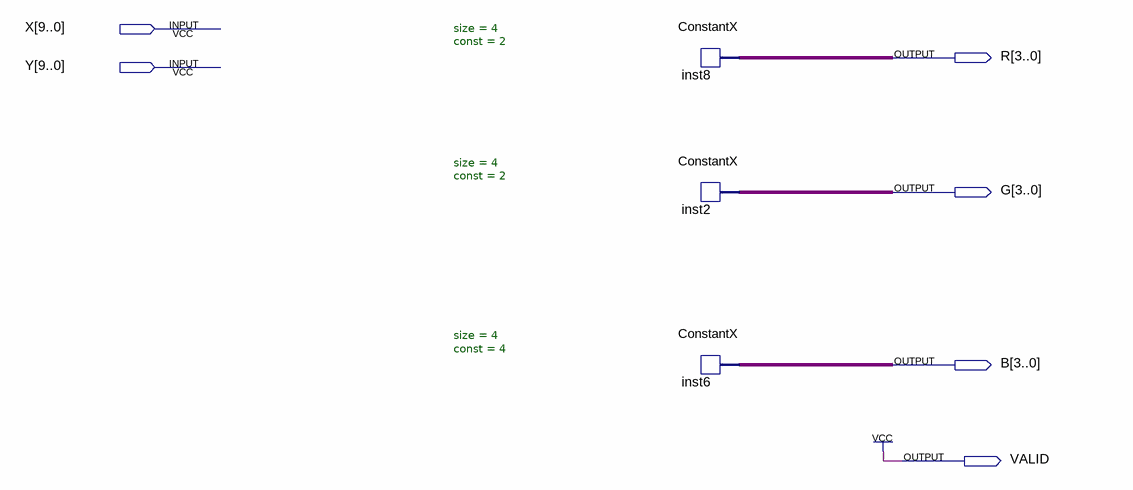
[diagram p0: schematic sheet]
// Quartus schematic Layer0.bdf as structural Verilog: 3 symbols, 6 pins
module Layer0 (
  input  [9:0] X,
  input  [9:0] Y,
  output [3:0] R,
  output [3:0] G,
  output [3:0] B,
  output VALID
);

  ConstantX #(.size(4), .\const (2)) inst8 (.DATA_OUT(R));
  ConstantX #(.size(4), .\const (2)) inst2 (.DATA_OUT(G));
  ConstantX #(.size(4), .\const (4)) inst6 (.DATA_OUT(B));

  assign VALID = 1'b1;
endmodule
